# Altium schematic sheet Sheet_1_2021-12-20.schdoc
size 49 x 26 mm
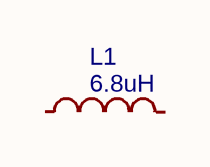
[diagram p0: Sheet_1_2021-12-20.schdoc]

## Parts
L1  6.8uH  [IND-SMD_L7.0-W6.6]

## Nets

Not connected (* = marked no-connect by the designer): L1 1 2

## Library data of the parts
L1 = 6.8uH: BOM_Manufacturer: Sunlord; BOM_Manufacturer Part: MWSA0603S-6R8MT; nameAlias: Inductance; Contributor: LCSC; BOM_Supplier: LCSC; BOM_Supplier Part: C408449; BOM_JLCPCB Part Class: Extended Part; spicePre: L; spiceSymbolName: MWSA0603S-6R8MT